# Altium project PCB_Project.PrjPcb
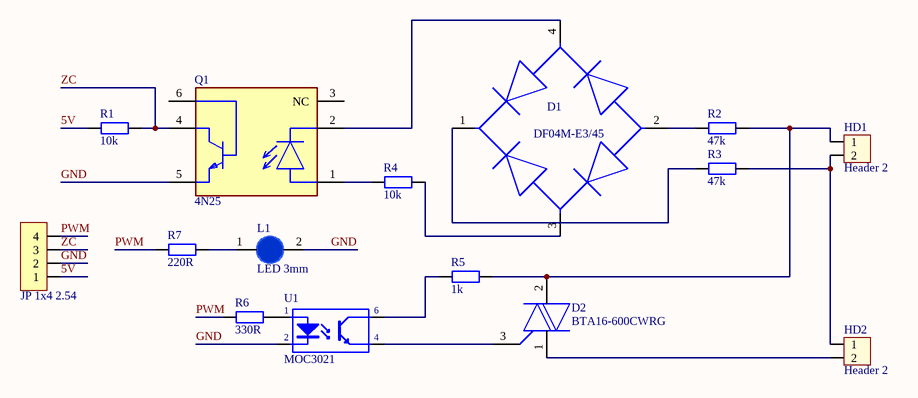
[diagram p0: Sheet2.SchDoc]
1 sheet, 15 parts. Net scope: global (net labels, ports and power ports of the same name join across sheets).
Board file: PCB2.PcbDoc

## Sheet Sheet2.SchDoc
size A; SheetNumber: 1; SheetTotal: 1

### Parts
D1  DF04M-E3/45  [FP-DF04M-E3-45-0]
D2  BTA16-600CWRG  [FP-TO-220AB_Ins-MFG]
HD1  Header 2  [HED2]
HD2  Header 2  [HED2]
JP1  JP 1x4 2.54  [JP 1x4 DT]
L1  LED 3mm  [LED-3MM-BLUE]
Q1  4N25  [FP-4N25-MFG]
R1  10k  [tro vach 1/4w]
R2  47k  [tro vach 1/4w]
R3  47k  [tro vach 1/4w]
R4  10k  [tro vach 1/4w]
R5  1k  [tro vach 1/4w]
R6  330R  [tro vach 1/4w]
R7  220R  [tro vach 1/4w]
U1  MOC3021  [DIP6/W0.3]

### Nets
5V: JP1.1 R1.1
GND: JP1.2 L1.2(K) Q1.5(C) U1.2(K)
PWM: JP1.4 R6.1 R7.1
ZC: JP1.3 Q1.4(E) R1.2
NetD1_1: D1.1(+) R3.1
NetD1_2: D1.2(-) R2.1
NetD1_3: D1.3(1_~) R4.2
NetD1_4: D1.4(2_~) Q1.2(C)
NetD2_1: D2.1(A1) HD2.2
NetD2_2: D2.2(A2) HD1.1 R2.2 R5.2
NetD2_3: D2.3(G) U1.4(E)
NetHD1_2: HD1.2 HD2.1 R3.2
NetL1_1: L1.1(A) R7.2
NetQ1_1: Q1.1(A) R4.1
NetR5_1: R5.1 U1.6(C)
NetR6_2: R6.2 U1.1(A)

Not connected (* = marked no-connect by the designer): Q1 3(NC) 6(B)

### Library data of the parts
D1 = CMP-00030-42173530-1: DF04M-E3/45 Rectifier Bridge Diode Single 400V 1A 4-Pin Case DFM Tube / BRIDGE RECT 1PHASE 400V 1A DFM; Peak Non-Repetitive Surge Current: 50A; Forward Voltage: 1.1V; Max Reverse Leakage Current: 5µA; Max Junction Temperature (Tj): 150°C; Number of Elements: 1; Capacitance: 25pF; NexarPartId: 42173530; Radiation Hardening: No; REACH SVHC: Unknown; Height: 3.3mm; Max Operating Temperature: 150°C; Element Configuration: Single; Width: 6.5mm; Length: 8.51mm; Min Operating Temperature: -55°C; Mount: Through Hole; Number of Pins: 4; Max Repetitive Reverse Voltage (Vrrm): 400V; Schedule B: 8541100080, 8541100080|8541100080|8541100080|8541100080|8541100080; Case/Package: DIP; RoHS: Compliant; Max Forward Surge Current (Ifsm): 50A; Max Surge Current: 50A; Forward Current: 1A; Average Rectified Current: 1A; Peak Reverse Current: 5µA; Reverse Voltage: 400V; Current Rating: 1A; Breakdown Voltage: 400V; Lead Free: Lead Free
D2 = CMP-12193-000001-1: TRIAC ALTERNISTOR 600V TO220AB; Manufacturer: STMicroelectronics; On State Current Rms: 16A; Gate Trigger Voltage: 1.3V; Gate Trigger Current: 35mA; Forward Voltage: 1.55V; Max Junction Temp: +125°C; Standoff Height: 3.75mm; Height: 19.65mm; Temperature Range Low: -40°C; Category: Diode; Device Class L2: Thyristors; ComponentLink2URL: https://www.st.com/resource/en/datasheet/bta16.pdf; Ipc Land Pattern Name: TO-220; Temperature: -40°C to +125°C; Temperature Range High: +125°C; Lead Free: Yes; Octopart: https://octopart.com/bta16-600cwrg-stmicroelectronics-360233; Device Class L3: TRIACs; Device Class L1: Discrete Semiconductors; Package: TO-220AB Ins; Manufacturer Part Number: BTA16-600CWRG; Digikey Description: TRIAC ALTERNISTOR 600V TO220AB; Off State Voltage: 600V; ComponentLink2Description: Datasheet; Hold Current: 35mA; Mouser Description: Triacs 16 Amp 600 Volt; RoHS: TRUE; Automotive: No
HD1 HD2 = Hed2: Header 2 (Green); Value: Header 2
JP1 = JP 1x4 2.54 Duc Thang: Cắm; Ten_Linh_Kien: Jump Đơn Đực 2.54MM 1x40P Thẳng 11MM; Don_Vi: Con; Ma_Hang: MH000903; Ghi_Chu: *; Kieu_Chan: *; Chung_Loai: Cắm
L1 = LED 3mm Xanh Duong: Cắm; Don_Vi: Con; Ma_Hang: MH009003; Ten_Linh_Kien: LED 3MM Xanh Dương SS (1000c); Ghi_Chu: *; Kieu_Chan: *; Chung_Loai: Cắm
Q1 = CMP-22018-000009-1: OPTOISO 2.5KV TRANS W/BASE 6DIP; Isolation Voltage: 5kV; Reverse Breakdown Voltage: 5V; Forward Voltage: 1.5V; Rise Time: 2us; Max Power Dissipation: 250mW; Collector Emitter Breakdown Voltage: 30V; Max Collector Current: 100mA; Collector Emitter Saturation Voltage: 500mV; Power Dissipation: 150mW; Number of Elements: 1; Forward Current: 60mA; Output Voltage: 70V; Input Type: DC; Max Input Current: 80mA; Input Current: 50mA; Current Transfer Ratio: 50%; Number of Pins: 6; Min Operating Temperature: -55°C; Radiation Hardening: No; Case/Package: PDIP; Fall Time: 2us; Lead Free: Lead Free; Series: -; Max Operating Temperature: 100°C; Output Current per Channel: 100mA; Number of Circuits: 1; Collector Emitter Voltage (VCEO): 30V; Isolation Voltage-Max: 5kV; Collector-emitter Voltage-Max: 500mV; Packaging: Rail/Tube; Mount: Through Hole; Package Quantity: 2000; Max Output Voltage: 30V; Number of Channels: 1
R1 R4 = Tro Vach 1/4W 1% 10k: Cắm; Don_Vi: Con; So_Chan: 2; Ten_Linh_Kien: Trở Vạch 1/4w 1% 10k; Ma_Hang: MH006349; Chung_Loai: Cắm; Kieu_Chan: *
R2 R3 = Tro Vach 1/4W 5% 47k: Cắm; Don_Vi: Con; So_Chan: 2; Ten_Linh_Kien: Trở Vạch 1/4w 5% 47k; Ma_Hang: MH004982; Chung_Loai: Cắm; Kieu_Chan: *
R5 = Tro Vach 1/4W 5% 1k: Cắm; Don_Vi: Con; So_Chan: 2; Ten_Linh_Kien: Trở Vạch 1/4w 5% 1k; Ma_Hang: MH007390; Chung_Loai: Cắm; Kieu_Chan: *
R6 = Tro Vach 1/4W 1% 330R: Cắm; Don_Vi: Con; So_Chan: 2; Ten_Linh_Kien: Trở Vạch 1/4w 1% 330R; Ma_Hang: MH006348; Chung_Loai: Cắm; Kieu_Chan: *
R7 = Tro Vach 1/4W 5% 220R: Cắm; Don_Vi: Con; So_Chan: 2; Ten_Linh_Kien: Trở Vạch 1/4w 5% 220R; Ma_Hang: MH007300; Chung_Loai: Cắm; Kieu_Chan: *
U1 = MOC3021: Single Opto; Value: MOC3021